# EasyEDA Pro project 1S-Bat-Charger.epro

# Schematic Schematic1
Board Name: Board1; Create Date: 2026-04-11; Page Name: P1; Project Name: 1S battery charger; Schematic Name: Schematic1; Update Date: 2026-04-11; Company: EasyEDA.com; Page Size: A4; Version: V1.0
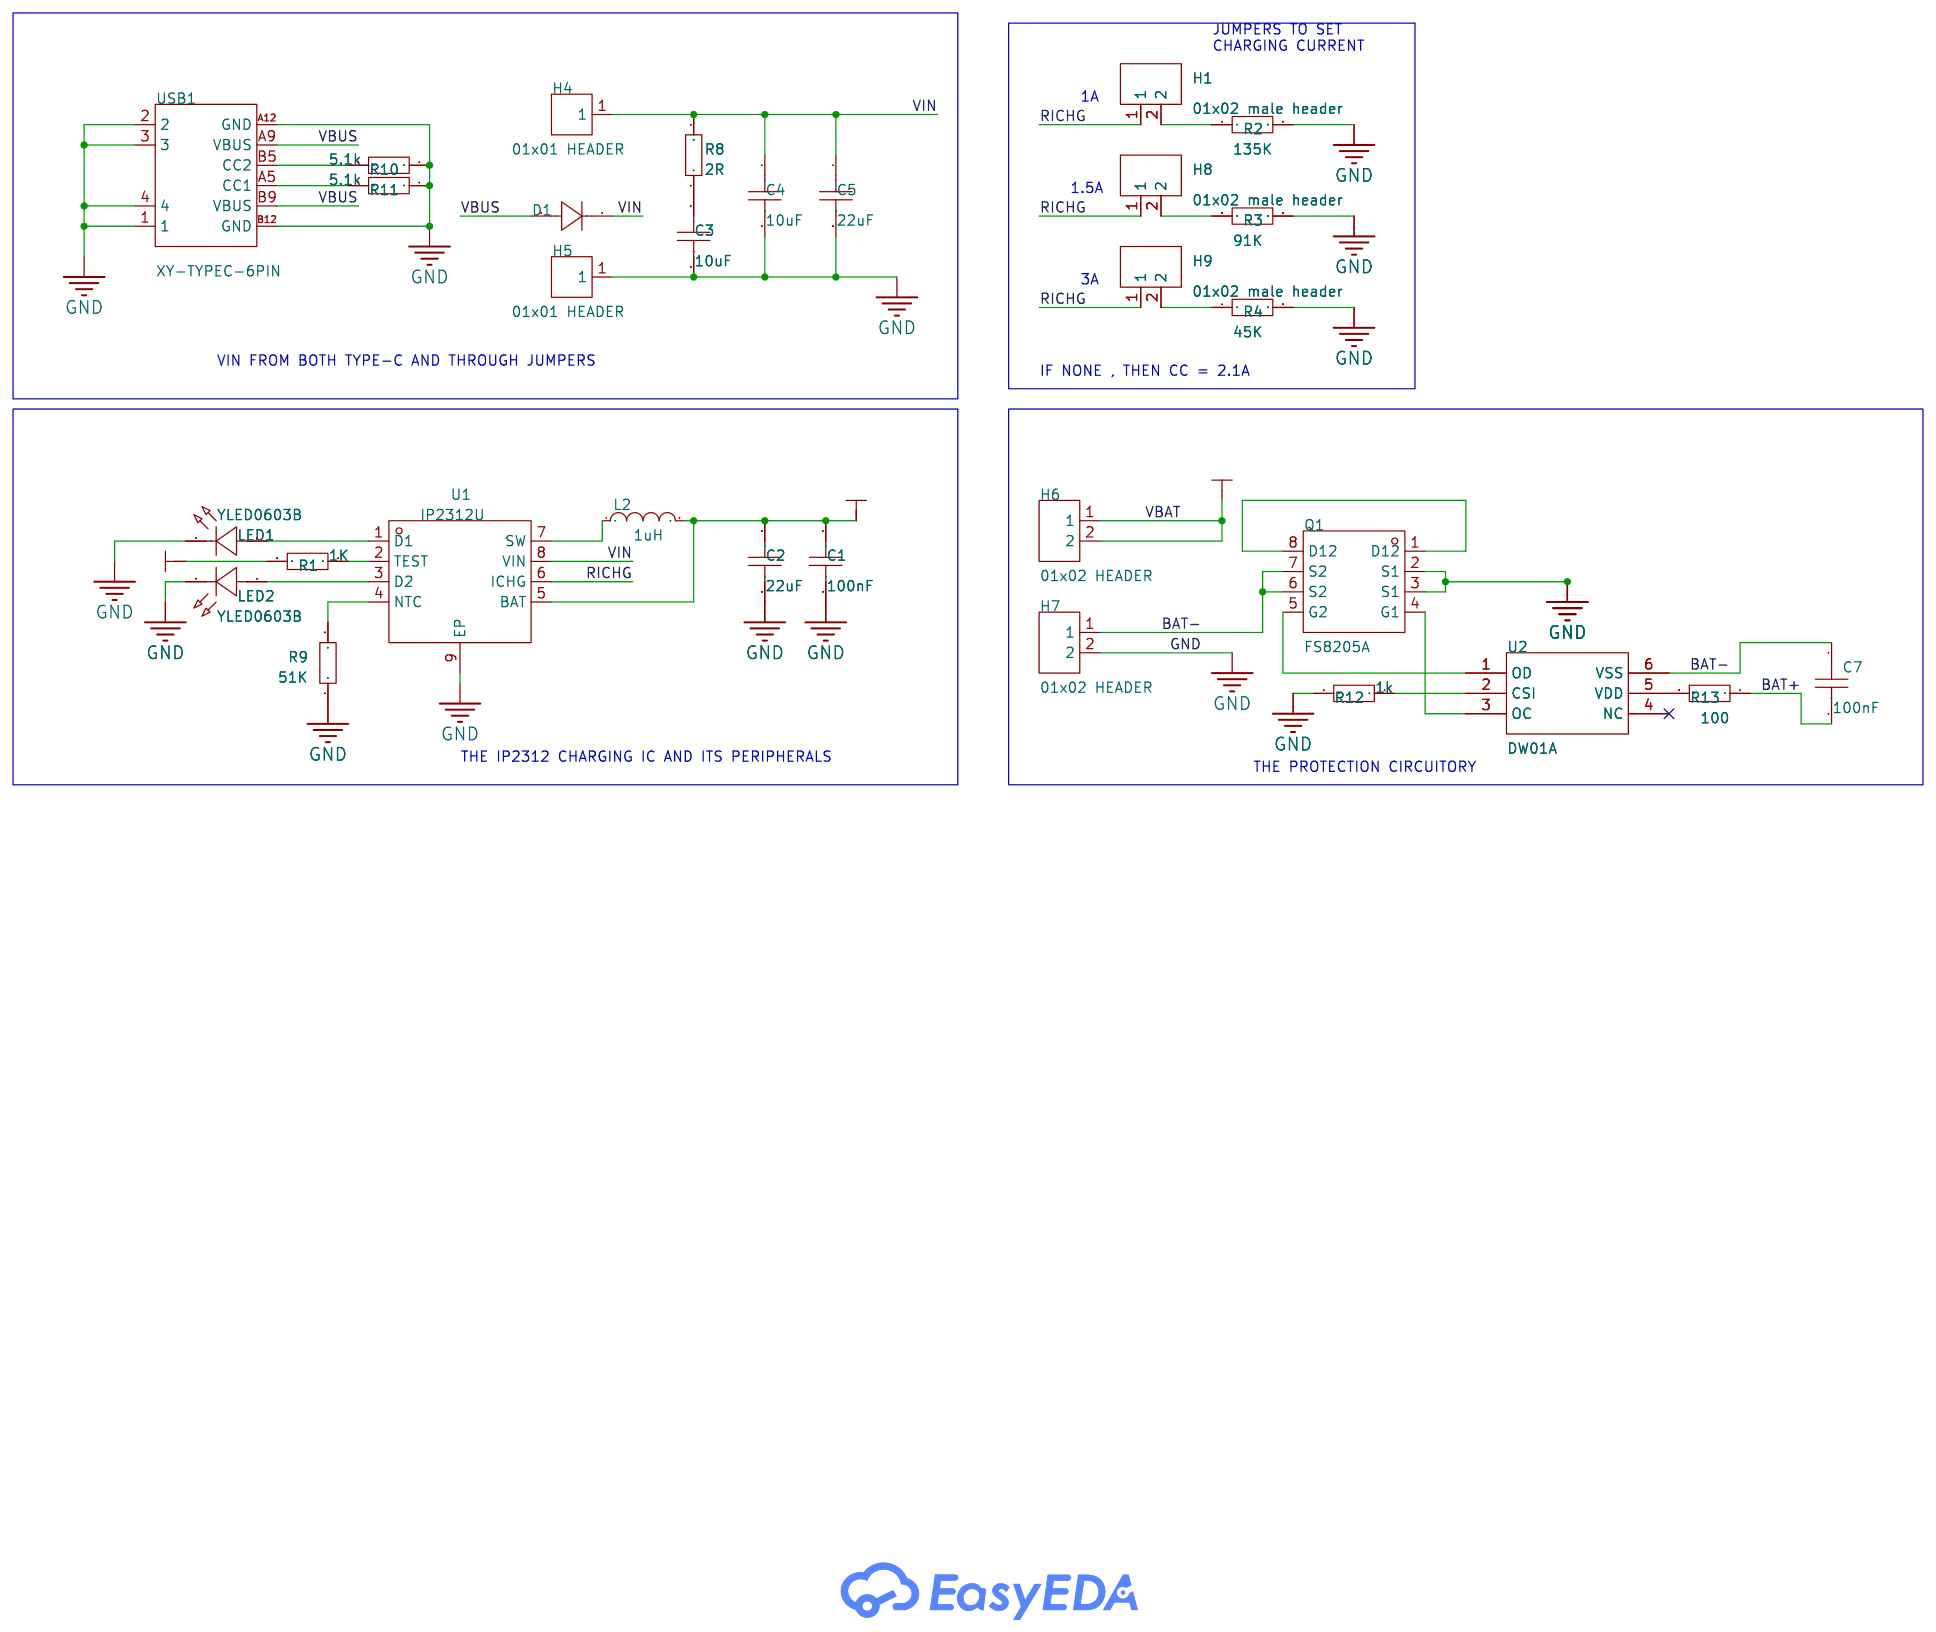
[diagram p0: schematic sheet]

## Parts
C1  100nF  [C0603]
C2  22uF  [C0603]
C3  10uF  [C0603]
C4  10uF  [C0603]
C5  22uF  [C0603]
C7  100nF  [C0603]
D1  -  [SMA_L4.4-W2.8-LS5.4-RD]
H1  01x02 male header  [SolderJumper-2_P1.3mm_Open_RoundedPad1.0x1.5mm]
H4  01x01 HEADER  [HDR-TH_1P-P2.54-V-M]
H5  01x01 HEADER  [HDR-TH_1P-P2.54-V-M]
H6  01x02 HEADER  [HDR-TH_2P-P2.54-V-M]
H7  01x02 HEADER  [HDR-TH_2P-P2.54-V-M]
H8  01x02 male header  [SolderJumper-2_P1.3mm_Open_RoundedPad1.0x1.5mm]
H9  01x02 male header  [SolderJumper-2_P1.3mm_Open_RoundedPad1.0x1.5mm]
L2  1uH  [IND-SMD_L4.4-W4.2]
LED1  YLED0603B  [LED0603-FD]
LED2  YLED0603B  [LED0603-FD]
Q1  FS8205A  [TSSOP-8_L4.4-W3.0-P0.65-LS6.4-BL-2]
R1  1K  [R0603]
R2  135K  [R0603]
R3  91K  [R0603]
R4  45K  [R0603]
R8  2R  [R0603]
R9  51K  [R0603]
R10  5.1k  [R0603]
R11  5.1k  [R0603]
R12  1k  [R0603]
R13  100  [R0603]
U1  IP2312U  [ESOP-8_L4.9-W3.9-P1.27-LS6.0-BL-EP]
U2  DW01A  [SOT-23-6_L2.9-W1.6-P0.95-LS2.8-BL]
USB1  XY-TYPEC-6PIN  [USB-C-SMD_XY-TYPEC-6PIN]

## Library data of the parts
C1-C5 C7 = CAP_0603: Supplier Footprint: 0603
D1 = 1N4007: Supplier Footprint: SMA(DO-214AC); Supplier Part: C727081
H1 H6-H9 = HX PH254-01-02-Z-L11.5 male header connector: Pin Structure:1x2P Pitch:2.54mm Circluar Pins/Square Pins:Pin Header Mounting Type:Through Hole Number of Rows:1 Number of Pins:2P Current Rating:3A Voltage Rating (Max):1kV Length of Mating Pin:6mm Insulation Height:2.5mm Length of End Connection Pin:3mm; LCSC Part Name: 1x2P 间距:2.54mm 方针 直插; Supplier Part: C52016390; Manufacturer: hanxia(韩下); Supplier Footprint: 插件,P=2.54mm; JLCPCB Part Class: Extended Part; Datasheet: https://item.szlcsc.com/datasheet/HX%2520PH254-01-02-Z-L11.5%2520male%2520header%2520connector/54760435.html; Supplier: LCSC; Pin Structure: 1x2P; Pitch: 2.54mm; Circluar Pins/Square Pins: Pin Header; Mounting Type: Through Hole; Number of Rows: 1; Number of Pins: 2P; Current Rating: 3A; Voltage Rating (Max): 1kV; Length of Mating Pin: 6mm; Insulation Height: 2.5mm; Length of End Connection Pin: 3mm; Contact Material: Brass; Contact Plating: Gold; Operating Temperature: -40℃~+105℃
H4 H5 = PH2.54-1X1P-H25: Pin Structure:1x1P Pitch:2.54mm Row Spacing:- Circluar Pins/Square Pins:Pin Header Mounting Type:Through Hole Number of Rows:1 Number of Pins:1P Current Rating:3A Voltage Rating (Max):- Length of Mating Pin:6mm Insulation Height:2.5mm Length of End Connec; LCSC Part Name: 1x1P 间距:2.54mm 方针 直插; Supplier Part: C42431799; Manufacturer: JXTCONN(聚兴泰); Supplier Footprint: 插件,P=2.54mm; JLCPCB Part Class: Extended Part; Datasheet: https://item.szlcsc.com/datasheet/PH2.54-1X1P-H25/44458929.html; Supplier: LCSC; Pin Structure: 1x1P; Pitch: 2.54mm; Circluar Pins/Square Pins: Pin Header; Mounting Type: Through Hole; Number of Rows: 1; Number of Pins: 1P; Current Rating: 3A; Length of Mating Pin: 6mm; Insulation Height: 2.5mm; Length of End Connection Pin: 3mm; Contact Material: Brass; Contact Plating: Gold; Operating Temperature: -40℃~+105℃; Color: Black
L2 = APH0420T1R0M: Inductance:1uH Tolerance:±20% Tolerance:±20% Current Rating:6A Current - Saturation(Isat):7A DC Resistance(DCR):27mΩ Type:Molded Inductor Ratings:-; LCSC Part Name: 1uH ±20% 7A; Supplier Part: C5349664; Manufacturer: APV(爱普微); Supplier Footprint: SMD,4.4x4.2mm; JLCPCB Part Class: Extended Part; Datasheet: https://item.szlcsc.com/datasheet/APH0420T1R0M/6135079.html; Supplier: LCSC; Tolerance: ±20%; Current Rating: 6A; Current - Saturation(Isat): 7A; DC Resistance(DCR): 27mΩ; Type: Molded Inductor
LED1 LED2 = YLED0603B: Lamp Holder Type:- Illumination Color:Blue Voltage - Forward(Vf):2.6V~3.2V Voltage - Forward(Vf):2.6V~3.2V Power(Watts):- Forward Current:30mA Wavelength - Dominant:460nm~475nm Wavelength - Dominant:460nm~475nm Peak Wavelength:- Diode Configuration:Discre; LCSC Part Name: 蓝色 独立二极管; Supplier Part: C19171394; Manufacturer: YONGYUTAI(永裕泰); Supplier Footprint: 0603; JLCPCB Part Class: Extended Part; Datasheet: https://item.szlcsc.com/datasheet/YLED0603B/20382445.html; Supplier: LCSC; Illumination Color: Blue; Voltage - Forward(Vf): 2.6V~3.2V; Forward Current: 30mA; Wavelength - Dominant: 460nm~475nm; Diode Configuration: Discrete Diode; Luminous Intensity: 42mcd~86mcd; Viewing Angle: 120°; Operating Temperature: -40℃~+85℃
Q1 = FS8205A_C16052: Number:2 N-Channel Drain to Source Voltage:20V Current - Continuous Drain(Id):9A RDS(on):35mΩ@2.5V,3A Pd - Power Dissipation:1W Gate Threshold Voltage (Vgs(th)):1V@250uA Gate Charge(Qg):- Input Capacitance(Ciss):- Reverse Transfer Capacitance (Crss@Vds):-; LCSC Part Name: 2个N沟道 耐压:20V 电流:6A; Supplier Part: C16052; Manufacturer: FORTUNE(富晶); Supplier Footprint: TSSOP-8; JLCPCB Part Class: Extended Part; Datasheet: https://item.szlcsc.com/datasheet/FS8205A/16734.html; Supplier: LCSC; Number: 2 N-Channel; Drain to Source Voltage: 20V; Current - Continuous Drain(Id): 9A; RDS(on): 35mΩ@2.5V,3A; Pd - Power Dissipation: 1W; Gate Threshold Voltage (Vgs(th)): 1V@250uA; Operating Temperature: -55℃~+150℃; Type: N-Channel
R1-R4 R8-R13 = Res_0603: Supplier Footprint: 0603
U1 = IP2312U: The Chip Type:Charging IC Voltage - Supply:4.5V~5.5V Voltage - Supply:4.5V~5.5V Charge Current - Max:3A Charging Saturation Voltage:4.2V End-Off Voltage:- Type of Battery:Lithium Battery Number of Cells:1 Number of Cells:1 Operating Temperature:-40℃~+150℃; LCSC Part Name: 停产 降压开关充电; Supplier Part: C2687800; Manufacturer: INJOINIC(英集芯); Supplier Footprint: SOP-8L; JLCPCB Part Class: Extended Part; Datasheet: https://item.szlcsc.com/datasheet/IP2312U/2792318.html; Supplier: LCSC; The Chip Type: Charging IC; Voltage - Supply: 4.5V~5.5V; Charge Current - Max: 3A; Charging Saturation Voltage: 4.2V; Type of Battery: Lithium Battery; Number of Cells: 1; Operating Temperature: -40℃~+150℃; Battery Temperature Detection: Support; Supply Current (Iq): 50uA
U2 = DW01A_C42459937: The Chip Type:Protection IC Voltage - Supply:1.5V~8V Voltage - Supply:1.5V~8V Charge Current - Max:- Charging Saturation Voltage:4.3V End-Off Voltage:2.4V Type of Battery:Lithium Battery Number of Cells:1 Number of Cells:1 Operating Temperature:-40℃~+85℃; LCSC Part Name: 电池保护IC; Supplier Part: C42459937; Manufacturer: KUU; Supplier Footprint: SOT-23-6; JLCPCB Part Class: Extended Part; Datasheet: https://item.szlcsc.com/datasheet/DW01A/44541817.html; Supplier: LCSC; The Chip Type: Protection IC; Voltage - Supply: 1.5V~8V; Charging Saturation Voltage: 4.3V; End-Off Voltage: 2.4V; Type of Battery: Lithium Battery; Number of Cells: 1; Operating Temperature: -40℃~+85℃; Battery Temperature Detection: Not supported; 0V Battery Charge: Support; Supply Current (Iq): 4uA
USB1 = XY-TYPEC-6PIN: LCSC Part Name: Type-C 母 卧贴; Supplier Part: C53133489; Manufacturer: XYECONN(辛译); Supplier Footprint: SMD; JLCPCB Part Class: Extended Part; Datasheet: https://item.szlcsc.com/datasheet/XY-TYPEC-6PIN/56122232.html; Supplier: LCSC

## Nets
GND: C1.2 C2.2 C3.2 C4.2 C5.2 H5.1 H7.2 LED1.1(K) LED2.1(K) Q1.2(S1) Q1.3(S1) R2.2 R3.2 R4.2 R9.1 R10.1 R11.1 R12.2 U1.9(EP) USB1.1 USB1.2 USB1.3 USB1.4 USB1.A12(GND) USB1.B12(GND)
VBAT: C1.1 C2.1 H6.1 H6.2 L2.2 R1.2 U1.5(BAT)
VBUS: D1.2(A) USB1.A9(VBUS) USB1.B9(VBUS)
VIN: C4.1 C5.1 D1.1(K) H4.1 R8.2 U1.8(VIN)
BAT+: C7.2 R13.1
BAT-: C7.1 H7.1 Q1.6(S2) Q1.7(S2) U2.6(VSS)
RICHG: H1.1 H8.1 H9.1 U1.6(ICHG)
$1N696: H1.2 R2.1
$1N726: H8.2 R3.1
$1N756: H9.2 R4.1
$1N863: L2.1 U1.7(SW)
$1N1166: R1.1 U1.2(TEST)
$1N1193: LED1.2(A) U1.1(D1)
$1N1245: LED2.2(A) U1.3(D2)
$1N2459: C3.1 R8.1
$1N2582: R9.2 U1.4(NTC)
$1N2872: R10.2 USB1.B5(CC2)
$1N2904: R11.2 USB1.A5(CC1)
$1N4478: Q1.1(D12) Q1.8(D12)
$1N4553: Q1.4(G1) U2.3(OC)
$1N4558: Q1.5(G2) U2.1(OD)
$1N4713: R12.1 U2.2(CSI)
$1N5016: R13.2 U2.5(VDD)

Not connected (* = marked no-connect by the designer): U2 4(NC)*

## Notes on the sheet
- JUMPERS TO SET
  CHARGING CURRENT
- 1A
- 1.5A
- 3A
- VIN FROM BOTH TYPE-C AND THROUGH JUMPERS
- IF NONE , THEN CC = 2.1A
- THE IP2312 CHARGING IC AND ITS PERIPHERALS
- THE PROTECTION CIRCUITORY

# Board PCB1
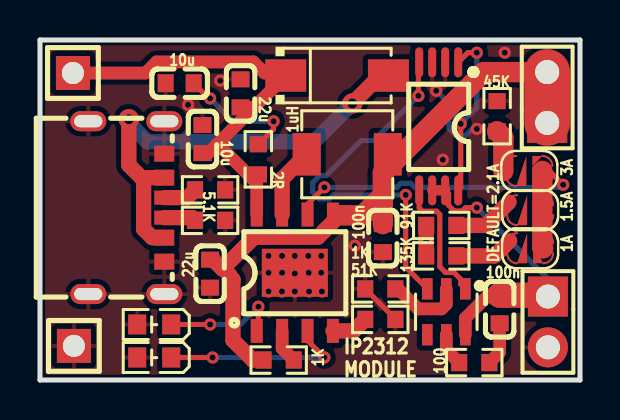
[diagram p1: board, top side]
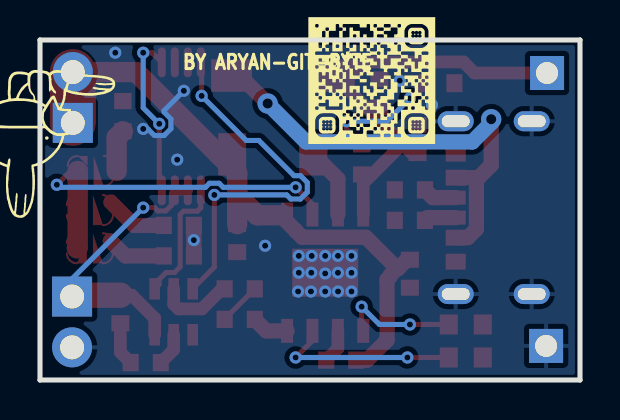
[diagram p2: board, bottom side, seen from below]

Outline 27 x 17 mm; copper layers: Top Layer, Bottom Layer. Coordinates in mm from the lower left corner of the outline.
Outline path: 0,17 27,17 27,0 0,0 0,17
Stack: Top Layer 0.035mm / Dielectric1 1.51mm FR4 er 4.5 / Bottom Layer 0.035mm

## Design rules (mm)
template: JLCPCB Capability(Two Layers Board)
spacing copperThickness1oz (default): track to track 0.102, other pairs 0.152 to 0.3
spacing copperThickness2oz: track to track 0.203, other pairs 0.152 to 0.3
track width copperThickness1oz (default): min 0.127, default 0.254, max 2.54
track width copperThickness2oz: min 0.203, default 0.254, max 2.54
differential pair differentialPair (default): width min 0.127, default 0.254, max 2.54; gap min 0.152, default 0.152
via viaSize (default): diameter min 0.5, default 0.61, max 10; hole min 0.3, default 0.305, max 6.3

## Placement (name value [footprint] x y rotation side)
C1  100nF  [C0603]  17.14 7.09 270 top
C2  22uF  [C0603]  8.5 5.32 270 top
C3  10uF  [C0603]  6.98 14.84 180 top
C4  10uF  [C0603]  8.12 12.05 90 top
C5  22uF  [C0603]  10.03 14.33 90 top
C7  100nF  [C0603]  22.98 3.54 270 top
D1  -  [SMA_L4.4-W2.8-LS5.4-RD]  14.86 15.22 0 top
H1  01x02 male header  [SolderJumper-2_P1.3mm_Open_RoundedPad1.0x1.5mm]  24.51 6.59 180 top
H4  01x01 HEADER  [HDR-TH_1P-P2.54-V-M]  1.65 15.35 0 top
H5  01x01 HEADER  [HDR-TH_1P-P2.54-V-M]  1.69 1.7 0 top
H6  01x02 HEADER  [HDR-TH_2P-P2.54-V-M]  25.36 14.13 90 top
H7  01x02 HEADER  [HDR-TH_2P-P2.54-V-M]  25.4 2.9 270 top
H8  01x02 male header  [SolderJumper-2_P1.3mm_Open_RoundedPad1.0x1.5mm]  24.51 8.49 180 top
H9  01x02 male header  [SolderJumper-2_P1.3mm_Open_RoundedPad1.0x1.5mm]  24.47 10.45 180 top
L2  1uH  [IND-SMD_L4.4-W4.2]  15.36 11.28 180 top
LED1  YLED0603B  [LED0603-FD]  5.71 2.78 0 top
LED2  YLED0603B  [LED0603-FD]  5.71 1.12 0 top
Q1  FS8205A  [TSSOP-8_L4.4-W3.0-P0.65-LS6.4-BL-2]  19.94 12.68 180 top
R1  1K  [R0603]  11.93 1 180 top
R2  135K  [R0603]  20.06 6.2 180 top
R3  91K  [R0603]  20.06 7.73 180 top
R4  45K  [R0603]  22.86 13.19 90 top
R8  2R  [R0603]  10.92 11.03 270 top
R9  51K  [R0603]  17.01 3.03 180 top
R10  5.1k  [R0603]  8.5 7.98 180 top
R11  5.1k  [R0603]  8.5 9.51 180 top
R12  1k  [R0603]  17.01 4.55 180 top
R13  100  [R0603]  21.71 0.87 180 top
U1  IP2312U  [ESOP-8_L4.9-W3.9-P1.27-LS6.0-BL-EP]  12.74 5.36 0 top
U2  DW01A  [SOT-23-6_L2.9-W1.6-P0.95-LS2.8-BL]  20.32 3.41 180 top
USB1  XY-TYPEC-6PIN  [USB-C-SMD_XY-TYPEC-6PIN]  4.31 8.62 270 top

## Footprints (pads in the part's own frame, mm; a bottom-side part is the same pattern mirrored in y, then rotated)
C0603
  rect 0.8x0.9 smd: 1(-0.7,0) 2(0.7,0)
ESOP-8_L4.9-W3.9-P1.27-LS6.0-BL-EP
  rect 0.6x1.2 smd: 1(-1.905,-2.909) 2(-0.635,-2.909) 3(0.635,-2.909) 4(1.905,-2.909) 5(1.905,2.909) 6(0.635,2.909) 7(-0.635,2.909) 8(-1.905,2.909)
  rect 3.3x2.4 smd: 9(0,0)
HDR-TH_1P-P2.54-V-M
  rect 1.7x1.7 hole 1.1: 1(0,0)
HDR-TH_2P-P2.54-V-M
  rect 2x2 hole 1.2: 1(-1.27,0)
  round 2 hole 1.2: 2(1.27,0)
IND-SMD_L4.4-W4.2
  rect 1.4x2.12 smd: 1(2.028,0) 2(-2.028,0)
LED0603-FD
  rect 0.9x1 smd: 1(-0.85,0) 2(0.85,0)
R0603
  rect 0.806x0.864 smd: 1(-0.753,0) 2(0.753,0)
SMA_L4.4-W2.8-LS5.4-RD
  rect 2.046x1.62 smd: 1(-2.566,0) 2(2.566,0)
SolderJumper-2_P1.3mm_Open_RoundedPad1.0x1.5mm
  custom 1x1.5 smd: 1(-0.65,0) 2(0.65,0)
SOT-23-6_L2.9-W1.6-P0.95-LS2.8-BL
  rect 0.532x1.072 smd: 1(-0.95,-1.149) 2(0,-1.149) 3(0.95,-1.149) 4(0.95,1.149) 5(0,1.149) 6(-0.95,1.149)
TSSOP-8_L4.4-W3.0-P0.65-LS6.4-BL-2
  oval 0.4x1.5 smd: 1(-0.975,-3.2) 2(-0.325,-3.2) 3(0.325,-3.2) 4(0.976,-3.2) 5(0.976,3.2) 6(0.325,3.2) 7(-0.325,3.2) 8(-0.975,3.2)
USB-C-SMD_XY-TYPEC-6PIN
  oval 1x1.8 hole 0.6x1.4: 1(-4.32,1.9) 2(4.32,1.9) 3(4.32,-1.9) 4(-4.32,-1.9)
  rect 0.7x1 smd: A5(-0.5,1.9) B5(0.5,1.9)
  rect 0.8x1 smd: A9(1.5,1.9) A12(2.7,1.9) B9(-1.5,1.9) B12(-2.7,1.9)

## Nets
As in the schematic.

Pads without a net: U2 4

## Via types
v1: diameter 0.61, hole 0.305, Top Layer to Bottom Layer, 36 vias
v2: diameter 1.016, hole 0.508, Top Layer to Bottom Layer, 2 vias

## Routing (per net, layer and track width the routed paths; a pad name or vN(x,y) marks a point on that pad's centre or on a via; arc(x,y) is an arc through that point)
GND: length 7.8
  Top Layer w0.254: R12.2 17.77,3.05 R9.1
  Top Layer w0.762: R2.2 v1(19.31,6.99) R3.2
  Bottom Layer w0.254: v1(19.81,14.46) 20.8,13.47 20.8,13.39 20.45,13.05 20.45,12.57 20.8,12.22 21.28,12.22 21.61,12.55 v1(21.84,12.55)
  vias: v1(7.4,13.76) v1(9.01,14.97) v1(11.43,6.2) v1(11.43,5.36) v1(11.43,4.43) v1(12.1,6.2) v1(12.1,5.36) v1(12.1,4.43) v1(12.74,6.2) v1(12.74,5.33) v1(12.74,4.43) v1(13.41,6.2) v1(13.44,5.36) v1(13.45,4.43) v1(14.06,6.2) v1(14.06,5.36) v1(14.09,4.43) v1(15.74,6.71) v1(20.14,11.02) v1(23.24,16.36)
VBAT: length 32.2
  Top Layer w0.762: 9.14,5.57 9.12,5.55 8.65,6.02 C2.1 ; 9.14,5.57 10.71,7.14 13.9,7.14 14.21,7.45 14.21,7.46 14.98,8.24 ; 9.14,5.57 9.16,5.55 9.18,5.55 9.49,5.24 9.49,5.18 9.65,5.02 9.65,1.99 10.64,1 R1.2
  Top Layer w1.016: 17.14,9.24 16.14,8.24 14.98,8.24 ; 17.14,9.24 C1.1 ; 17.14,9.24 17.14,10.35 18.08,11.28 ; H6.2 22.19,15.4 18.08,11.28 ; 18.08,11.28 17.39,11.28
  Top Layer w2.286: H6.2 H6.1
VBUS: length 23.1
  Top Layer w0.762: USB1.A9 5.61,7.12 5.18,7.55 5.18,10.01 5.07,10.12 ; 5.07,10.12 4.44,10.75 v2(4.44,13.04) ; 5.07,10.12 USB1.B9 ; v2(15.62,13.82) 17.01,15.22 D1.2
  Bottom Layer w0.762: v2(4.44,13.04) 4.44,12.85 5.39,11.91 13.7,11.91 v2(15.62,13.82)
VIN: length 22.5
  Top Layer w0.635: H4.1 5.28,15.35 5.83,15.9 10.67,15.9 11.23,15.35 12.16,15.35 D1.1 10.7,13.63 ; U1.8 10.84,9.84 10.4,10.28 ; 8.87,11.81 10.4,10.28 ; 8.87,11.81 8.41,11.35 C4.1 ; 8.87,11.81 10.7,13.63 ; 10.4,10.28 R8.2 ; 10.7,13.63 C5.1
BAT+: length 2.2
  Top Layer w0.635: C7.2 22.98,1.39 R13.1
BAT-: length 14.4
  Top Layer w0.254: Q1.7 20.43,9.31 20.43,8.73 20.71,8.45 21.11,8.45 21.27,8.62 v1(21.84,8.62)
  Top Layer w0.508: Q1.7 Q1.6
  Top Layer w0.635: C7.1 22.41,4.24 21.27,3.09 U2.6
  Top Layer w1.27: C7.1 25.33,4.24 H7.1
  Bottom Layer w0.254: H7.1 25.4,5.06 v1(21.84,8.62)
RICHG: length 19.1
  Top Layer w0.254: v1(26.16,9.76) 25.47,10.45 H9.1 ; U1.6 13.38,8.79 v1(14.22,9.63)
  Top Layer w1.016: H1.1 25.12,6.63 H9.1
  Bottom Layer w0.254: v1(14.22,9.63) 17.84,9.63 18.04,9.84 18.53,9.84 18.73,9.63 26.03,9.63 v1(26.16,9.76)
$1N696: length 3
  Top Layer w0.762: R2.1 22.73,6.2 23.48,6.96
$1N726: length 3.1
  Top Layer w0.762: R3.1 22.29,7.73 23.45,8.9
$1N756: length 2.1
  Top Layer w1.016: 23.17,10.45 23.17,12.13 R4.1
$1N863: length 3.5
  Top Layer w0.762: U1.7 12.11,10.06 L2.1
$1N1166: length 1.7
  Top Layer w0.635: U1.2 12.11,1.58 R1.1
$1N1193: length 6
  Top Layer w0.254: U1.1 10.92,2.54 v1(10.92,3.66) ; LED1.2 v1(8.5,2.78)
  Bottom Layer w0.254: v1(10.92,3.66) 10.03,2.78 v1(8.5,2.78)
$1N1245: length 9.3
  Top Layer w0.254: U1.3 13.38,1.97 v1(14.22,1.12) ; LED2.2 v1(8.63,1.12)
  Bottom Layer w0.254: v1(8.63,1.12) v1(14.22,1.12)
$1N2459: length 6.3
  Top Layer w0.254: v1(11.68,12.94) 11.68,12.55 R8.1 ; v1(8.5,14.08) 8.44,14.08 C3.1
  Bottom Layer w0.254: v1(11.68,12.94) 9.65,12.94 v1(8.5,14.08)
$1N2582: length 1.9
  Top Layer w0.762: U1.4 15.69,2.45 R9.2
$1N2872: length 1.6
  Top Layer w0.762: R10.2 7.62,8.12 USB1.B5
$1N2904: length 1.7
  Top Layer w0.762: R11.2 7.36,9.12 USB1.A5
$1N4478: length 8.4
  Top Layer w0.254: v1(21.84,16.36) 21.39,16.36 Q1.1 ; v1(21.04,12.81) 21.04,9.61 Q1.8
  Bottom Layer w0.254: v1(21.04,12.81) 21.84,13.61 v1(21.84,16.36)
$1N4553: length 19.3
  Top Layer w0.254: v1(18.28,9.25) 18.28,5.64 U2.3 ; v1(18.92,14.21) 18.92,15.84 Q1.4
  Bottom Layer w0.254: v1(18.28,9.25) 14.67,9.25 14.46,9.05 13.98,9.05 13.64,9.39 13.64,9.88 13.98,10.22 14.3,10.22 16.06,11.98 16.69,11.98 v1(18.92,14.21)
$1N4558: length 6.5
  Top Layer w0.254: Q1.5 18.96,8.61 19.13,8.44 19.83,8.44 19.99,8.28 19.99,5.66 20.27,5.38 20.7,5.38 21.04,5.03 21.04,4.79 U2.1
$1N4713: length 3.8
  Top Layer w0.635: U2.2 20.32,3.79 20.08,3.55 18.91,3.55 17.91,4.55 R12.1
$1N5016: length 1.7
  Top Layer w0.635: U2.5 20.32,1.51 R13.2

## Copper pours and planes (outline as drawn; the poured copper is in the pictures)
GND on Top Layer: 0,17 27,17 27,0 0,0
GND on Bottom Layer: 0,17 27,17 27,0 0,0

## Text on the board
Bottom Silkscreen Layer: BY ARYAN-GIT-BYTE
Top Silkscreen Layer: DEFAULT=2.1A | 3A | 1.5A | 1A | 100 | 1K / 51K | 45K | 100n | 22u | 1K | 91K | 135K | 5.1K | 10u | 1uH | 2R | IP2312 / MODULE
